# Altium schematic sheet TOP_Sheet.SchDoc
size A4; Organization: HTL Hollabrunn; Address1: Abteilung Elektronik; Address2: Anton Ehrenfried-Straße 10; Address3: 2020 Hollabrunn; SPICEModelCacheBIRIWKQP: <root> / <DocumentId>BIRIWKQP</DocumentId> / </root>
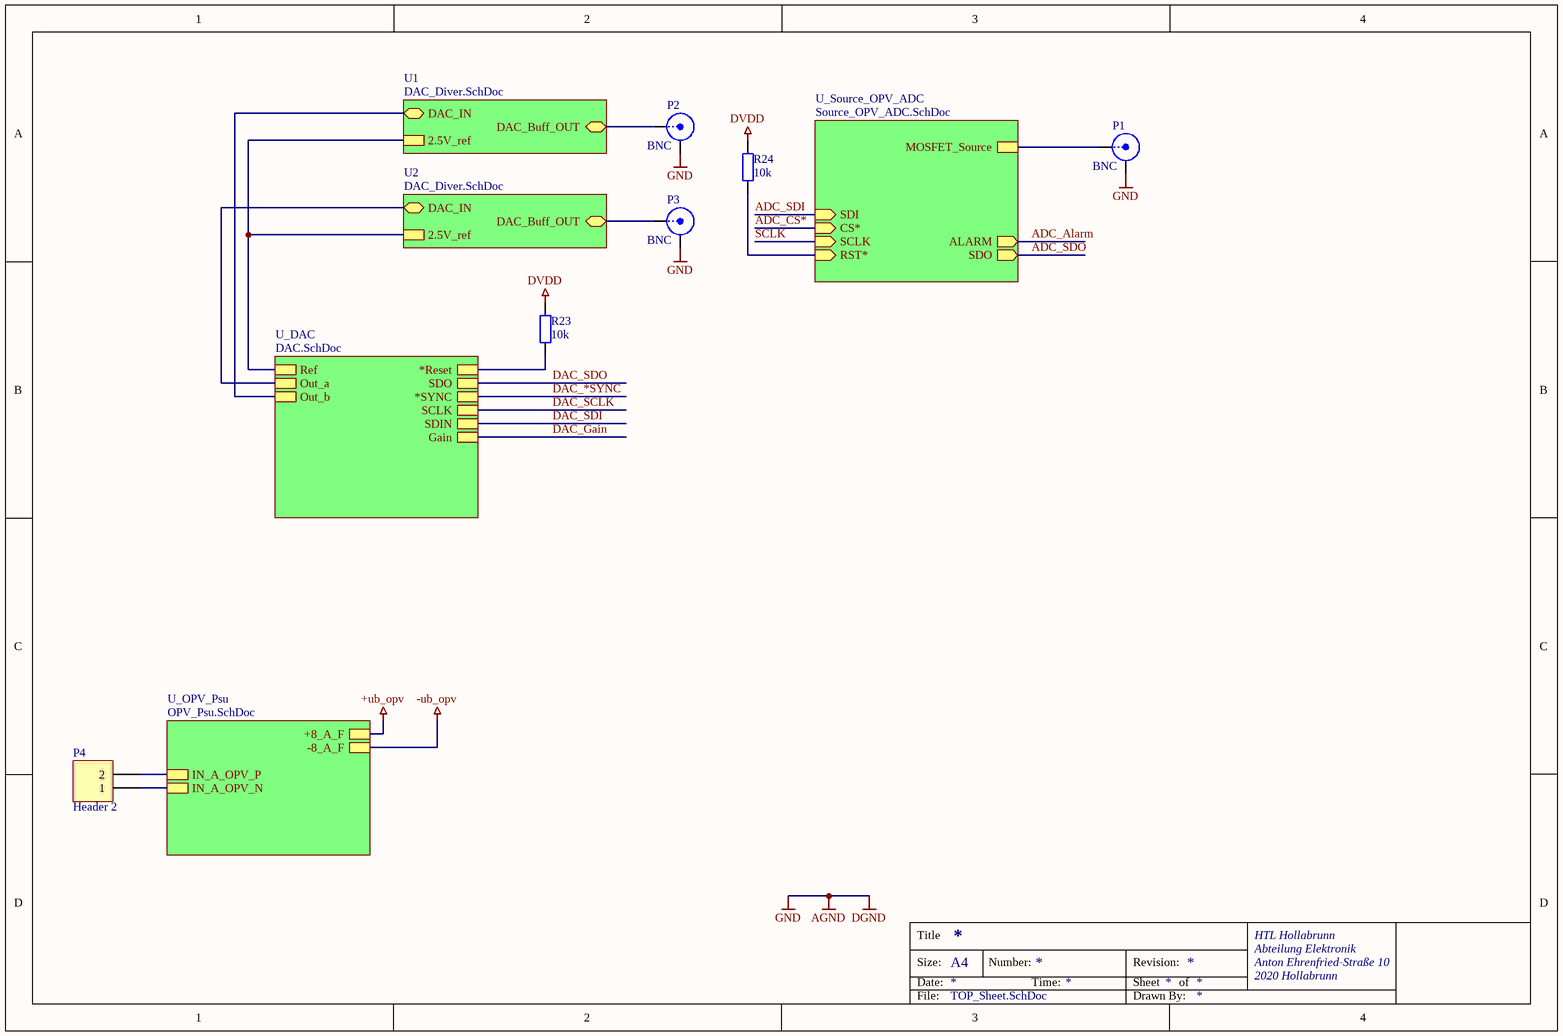
[diagram p0: TOP_Sheet.SchDoc]

## Parts
P1  BNC  [BNC_RA CON]
P2  BNC  [BNC_RA CON]
P3  BNC  [BNC_RA CON]
P4  Header 2  [HDR1X2]
R23  10k  [C1206-KUE]
R24  10k  [C1206-KUE]

## Sub-sheets
U1 = DAC_Diver.SchDoc: DAC_IN (bidir), DAC_Buff_OUT (bidir), 2.5V_ref
U2 = DAC_Diver.SchDoc: DAC_IN (bidir), DAC_Buff_OUT (bidir), 2.5V_ref
U_DAC = DAC.SchDoc: Ref, Out_a, Out_b, SDIN, SDO, SCLK, *SYNC, Gain, *Reset
U_OPV_Psu = OPV_Psu.SchDoc: IN_A_OPV_P, +8_A_F, IN_A_OPV_N, -8_A_F
U_Source_OPV_ADC = Source_OPV_ADC.SchDoc: MOSFET_Source, SDI (in), CS* (in), SCLK (in), SDO (out), ALARM (out), RST* (in)

## Nets
+ub_opv: sheet U_OPV_Psu/+8_A_F
-ub_opv: sheet U_OPV_Psu/-8_A_F
AGND: P1.2(Y) P2.2(Y) P3.2(Y)  [also labelled DGND, GND]
DVDD: R23.1 R24.1
ADC_Alarm: sheet U_Source_OPV_ADC/ALARM
ADC_CS*: sheet U_Source_OPV_ADC/CS*
ADC_SDI: sheet U_Source_OPV_ADC/SDI
ADC_SDO: sheet U_Source_OPV_ADC/SDO
DAC_*SYNC: sheet U_DAC/*SYNC
DAC_Gain: sheet U_DAC/Gain
DAC_SCLK: sheet U_DAC/SCLK
DAC_SDI: sheet U_DAC/SDIN
DAC_SDO: sheet U_DAC/SDO
SCLK: sheet U_Source_OPV_ADC/SCLK
NetP1_1: P1.1(X) ; sheet U_Source_OPV_ADC/MOSFET_Source
NetP2_1: P2.1(X) ; sheet U1/DAC_Buff_OUT
NetP3_1: P3.1(X) ; sheet U2/DAC_Buff_OUT
NetP4_1: P4.1 ; sheet U_OPV_Psu/IN_A_OPV_N
NetP4_2: P4.2 ; sheet U_OPV_Psu/IN_A_OPV_P
NetR23_2: R23.2 ; sheet U_DAC/*Reset
NetR24_2: R24.2 ; sheet U_Source_OPV_ADC/RST*
(unnamed): sheet U2/DAC_IN, sheet U_DAC/Out_a
(unnamed): sheet U2/2.5V_ref, sheet U1/2.5V_ref, sheet U_DAC/Ref
(unnamed): sheet U1/DAC_IN, sheet U_DAC/Out_b

## Notes on the sheet
- Title
- Size:
- Date:
- A4
- Number:
- Time:
- Revision:
- Sheet
- of
- HTL Hollabrunn
- Abteilung Elektronik
- Anton Ehrenfried-Straße 10
- 2020 Hollabrunn
- File:
- Drawn By:

## Library data of the parts
P1-P3 = BNC: BNC Elbow Connector; LatestRevisionDate: 17-Jul-2002; LatestRevisionNote: Re-released for DXP Platform.; Publisher: Altium Limited
P4 = Header 2: Header, 2-Pin; LatestRevisionDate: 17-Jul-2002; LatestRevisionNote: Re-released for DXP Platform.; Publisher: Altium Limited
R23 R24 = ResistorSMD: Resistor SMD; Manufacturer: AVX; Bezeichnung: SMD Wid. 1/8W 2%; Published: 8-Jun-2000; LatestRevisionDate: 17-Jul-2002; LatestRevisionNote: Re-released for DXP Platform.; PackageReference: AXIAL-0.4; Publisher: Altium Limited; PackageDescription: Axial Device, Thru-Hole; 2 Leads; 0.4 in Pin Spacing; Value: 10k; Orderingcode: *